# EAGLE design fp_bnc (EAGLE 9.3.2)
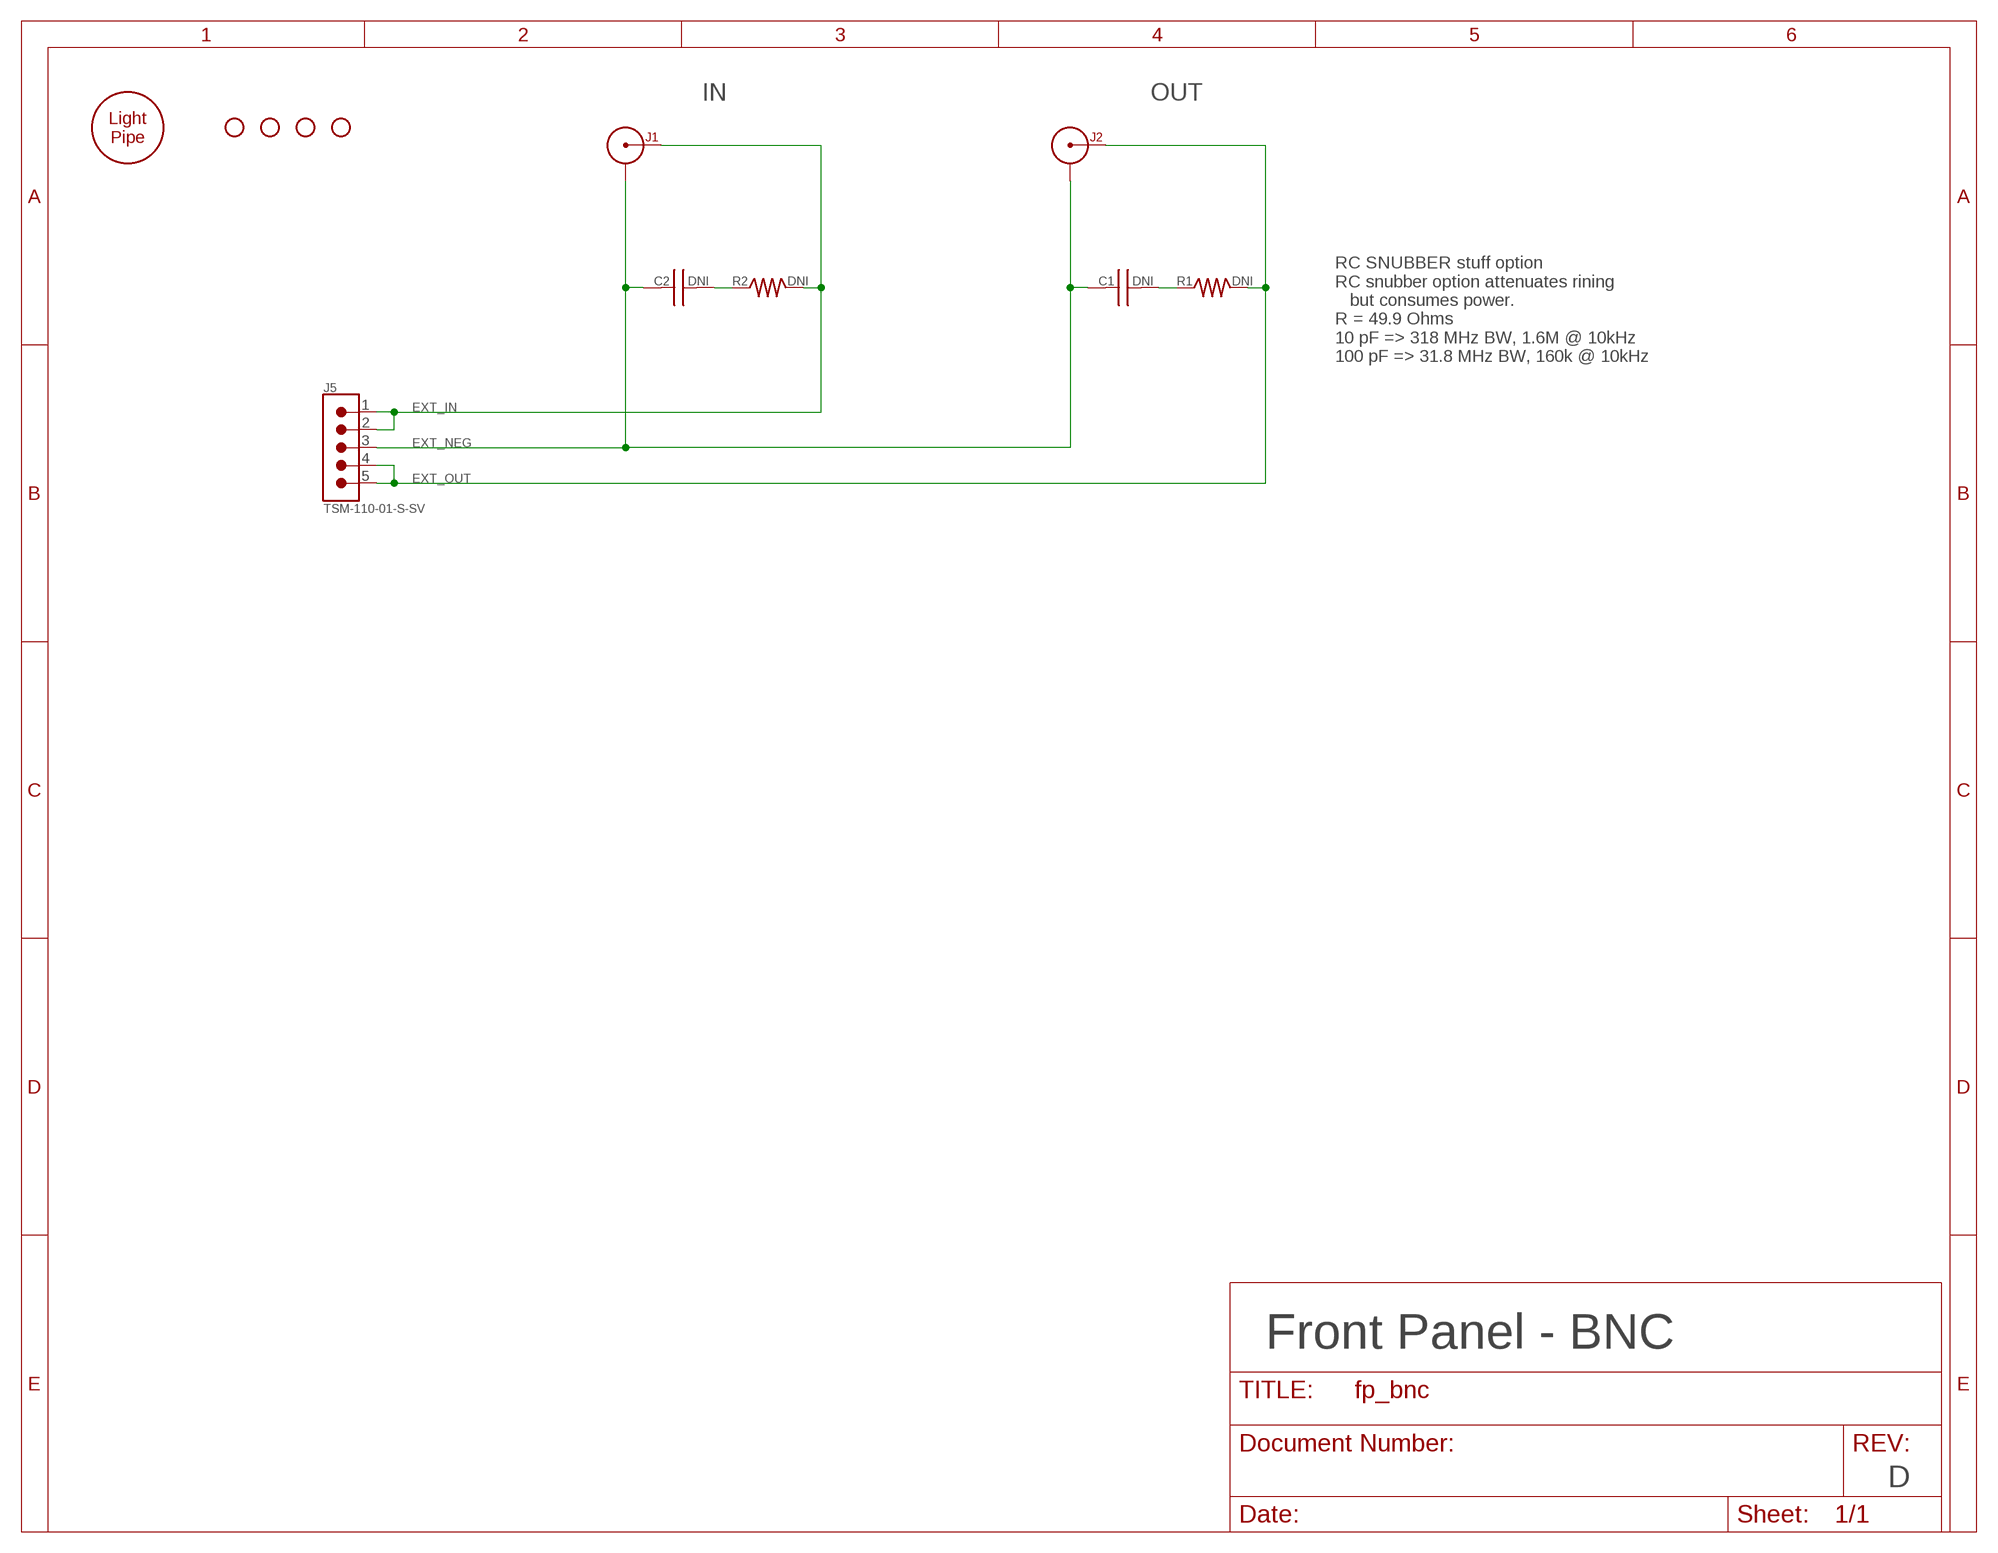
[diagram p0: schematic, sheet 1]

## Parts
C1  DNI  CAP_0603  [0603]
C2  DNI  CAP_0603  [0603]
H1  51513020125F  LIGHT_PIPE_PANEL_3MM  [LP_3MM]
H2  HOLE_#6  [HOLE_3.5MM]
H3  HOLE_#6  [HOLE_3.5MM]
H4  HOLE_#6  [HOLE_3.5MM]
H5  HOLE_#6  [HOLE_3.5MM]
J1  031-5329-52RFX  BNC_JACKBNC_31-5329-52RFX  [BNC_31-5329-52RFX]
J2  031-5329-52RFX  BNC_JACKBNC_31-5329-52RFX  [BNC_31-5329-52RFX]
J5  TSM-110-01-S-SV  CONN_0.1_5X1_MS  [CONN_0.1_5X1_MS]
R1  DNI  RESISTOR_1206  [1206]
R2  DNI  RESISTOR_1206  [1206]

## Nets
EXT_IN: J1.SIGNAL J5.1 J5.2 R2.2
EXT_NEG: C1.1 C2.1 J1.G@1(SHIELD) J1.G@2(SHIELD) J1.G@3(SHIELD) J1.G@4(SHIELD) J2.G@1(SHIELD) J2.G@2(SHIELD) J2.G@3(SHIELD) J2.G@4(SHIELD) J5.3
EXT_OUT: J2.SIGNAL J5.4 J5.5 R1.2
N$1: C2.2 R2.1
N$2: C1.2 R1.1

## Notes on the sheet
- IN | OUT
- RC SNUBBER stuff option
  RC snubber option attenuates rining
     but consumes power.
  R = 49.9 Ohms
  10 pF => 318 MHz BW, 1.6M @ 10kHz
  100 pF => 31.8 MHz BW, 160k @ 10kHz
- Front Panel - BNC
- D

## Library data of the parts
C1 C2 = jetperch:CAP; POPULATE: 0
H1 = jetperch:LIGHT_PIPE; MPN: 51513020125F; POPULATE: 1
H2-H5 = jetperch:HOLE; POPULATE: 0
J1 J2 = jetperch:BNC_JACK: BNC Jack (female) 31-5640-1010 is right angle, through hole 31-5329-52RFX is straight, through hole; MPN: 031-5329-52RFX; POPULATE: 1
J5 = jetperch:CONN_0.1_5X1; MPN: TSM-110-01-S-SV; POPULATE: 1
R1 R2 = jetperch:RESISTOR; POPULATE: 0

## Board
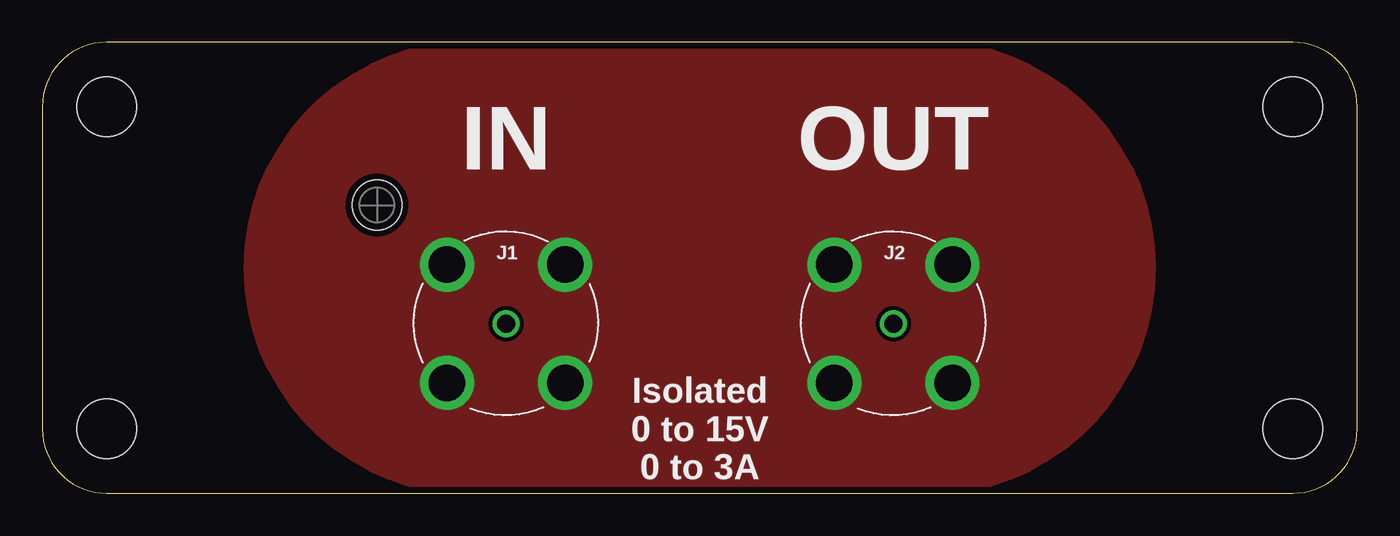
[diagram p1: board, top side]
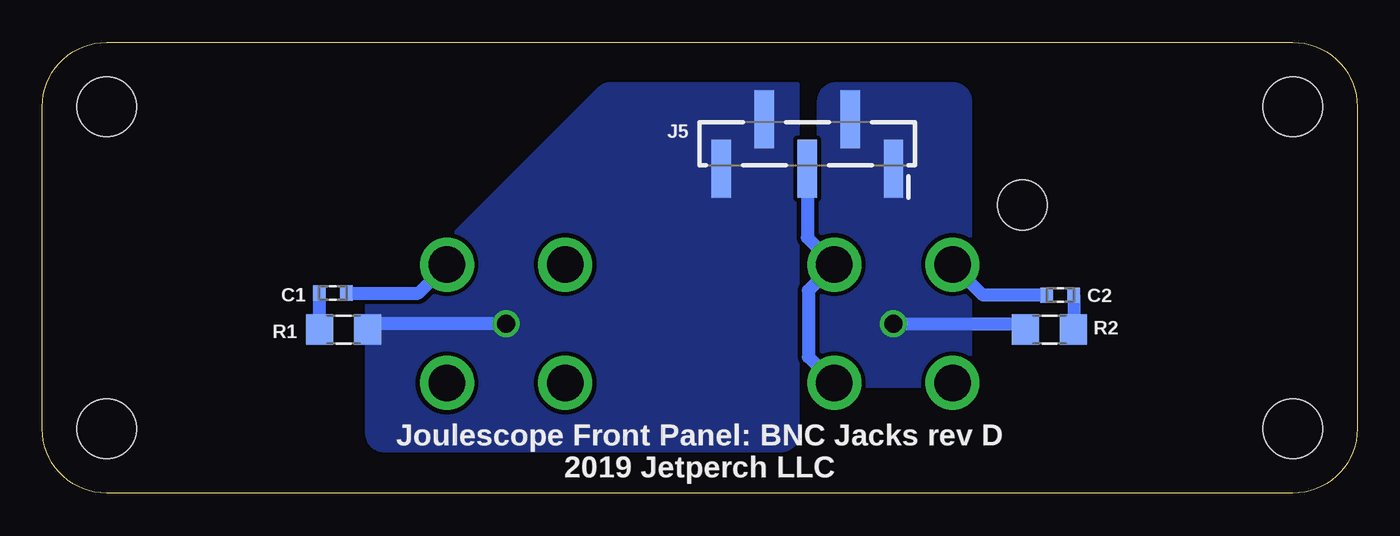
[diagram p2: board, bottom side, seen from below]

Size 77.6 x 26.6 mm. Coordinates in mm from the lower left corner, seen from the top.
Outline: 0,22.81 0,3.79 arc90 3.79,0 73.81,0 arc90 77.6,3.79 77.6,22.81 arc90 73.81,26.6 3.79,26.6 arc90 0,22.81
Copper layers (1*16): Top 0.035mm / dielectric 62mil / Bottom 0.035mm
Design rules "jetperch_2layer *": minimum track width 6mil, minimum drill 15mil, track to track 10mil, track to pad 10mil, pad to pad 10mil, via to via 10mil, smd to smd 0mil, copper to edge 15mil, drill to drill 15mil, minimum pad ring 6mil, minimum via ring 6mil, stop-mask expansion 2mil, vias tented up to drill 15mil, thermal gap 10mil
bKeepout: area 0,17.3 to 25.5,19.3; area 39.5,17.3 to 77.6,19.3; area 0,0 to 77.6,1.5; area 0,25.1 to 77.6,26.6; area 0,0 to 1.5,26.6; area 76.1,0 to 77.6,26.6

### Footprints (pad centres in the part's own frame; a part is rotated, then mirrored left to right if it is on the bottom)
0603 = smd 0.75 x 0.9: 1 -0.8,0; 2 0.8,0
LP_3MM = hole 2.921: 0,0
HOLE_3.5MM = hole 3.5: 0,0
BNC_31-5329-52RFX = drill 2.159: G@1 -3.489,3.489; G@2 3.489,3.489; G@3 3.489,-3.489; G@4 -3.489,-3.489 | drill 1.05: SIGNAL 0,0
CONN_0.1_5X1_MS = smd 1.143 x 3.429: 1 -5.08,1.46; 2 -2.54,-1.46; 3 0,1.46; 4 2.54,-1.46; 5 5.08,1.46
1206 = smd 1.6 x 1.803: 1 -1.422,0; 2 1.422,0

### Placement (x,y rotation side)
C1  60.45,11.81 180 bottom
C2  17.53,11.68 0 bottom
H1  19.75,17 0 top
H2  73.81,22.81 0 top
H3  3.79,3.79 0 top
H4  3.79,22.81 0 top
H5  73.81,3.79 0 top
J1  27.37,10 0 top
J2  50.23,10 0 top
J5  32.45,20.61 180 bottom
R1  59.82,9.65 0 bottom
R2  18.16,9.65 180 bottom

### Tracks (layer width: path | path; a pad name or v marks a point on that pad's centre or on a via)
EXT_IN
  Bottom 0.762: J1.SIGNAL 19.93,10 R2.2
  pour Bottom (isolate 0.254, no thermals): 31.75,6.35 31.75,23.13 arc90 30.75,24.13 23.86,24.13 arc90 22.86,23.13 22.86,6.35
EXT_NEG
  Bottom 0.762: J5.3 32.45,15.08 J1.G@2 32.38,11.96 32.38,8.04 J1.G@3 | C1.1 55.4,11.81 J2.G@2 | C2.1 22.08,11.68 J1.G@1
  pour Top (no thermals): 52.3,0 25.3,0 arc-90 12,13.3 arc-90 25.3,26.6 52.3,26.6 arc-90 65.6,13.3 arc-90
EXT_OUT
  Bottom 0.762: J2.SIGNAL 58.05,10 R1.2
  pour Bottom (isolate 0.254, no thermals): 33.02,24.13 44.04,24.13 arc-45 44.74,23.84 56.64,11.94 58.42,11.94 58.42,3.54 arc-90 57.42,2.54 34.02,2.54 arc-90 33.02,3.54
N$1
  Bottom 0.762: C2.2 16.73,9.66 R2.1
N$2
  Bottom 0.762: R1.1 61.24,11.8 C1.2

### Text on the board
_tsilk: IN | OUT | Isolated / 0 to 15V / 0 to 3A
_bsilk: Joulescope Front Panel: BNC Jacks rev D / 2019 Jetperch LLC